# EAGLE design SCH1001-001-012-320 - Counter ALU (EAGLE 9.4.2)

## Sheet 1 of 2
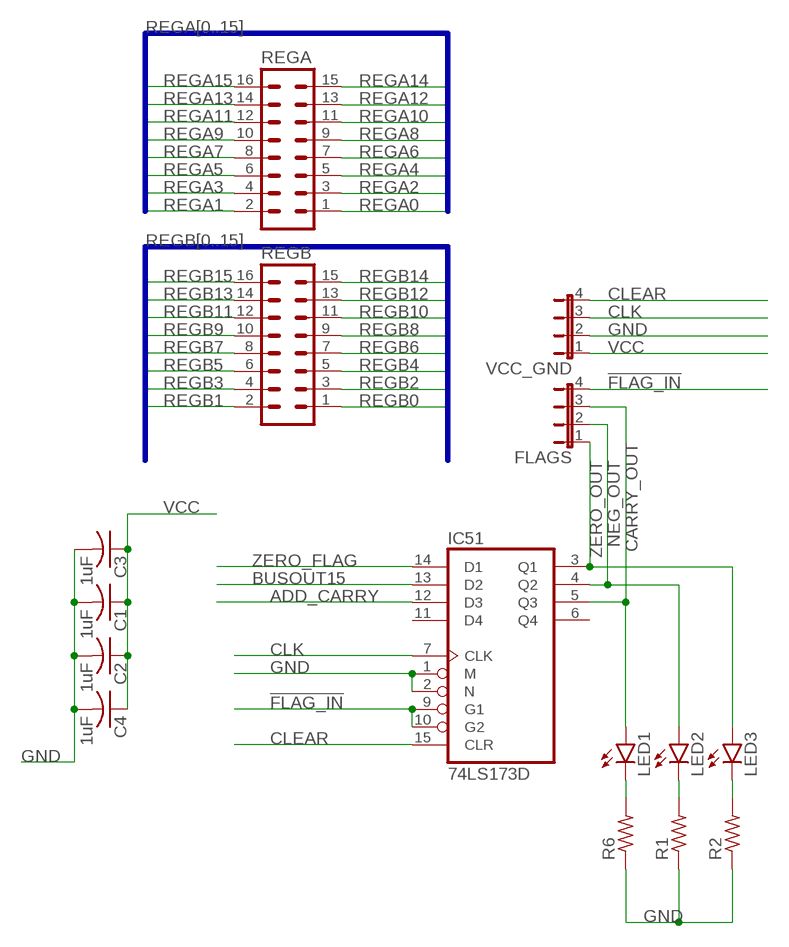
[diagram p0: schematic, sheet 1]

### Parts
C1  1uF  C-USC1206  [C1206]
C2  1uF  C-USC1206  [C1206]
C3  1uF  C-USC1206  [C1206]
C4  1uF  C-USC1206  [C1206]
FLAGS  JP4E  [JP4]
IC51  74LS173D  [SO16]
LED1  LED5MM  [LED5MM]
LED2  LED5MM  [LED5MM]
LED3  LED5MM  [LED5MM]
R1  R-US_M1206  [M1206]
R2  R-US_M1206  [M1206]
R6  R-US_M1206  [M1206]
REGA  ML16  [ML16]
REGB  ML16  [ML16]
VCC_GND  JP4E  [JP4]

### Nets
!FLAG_IN: FLAGS.4 IC51.9(G1) IC51.10(G2)
ADD_CARRY: IC51.12(D3) ; also sheet 2
BUSOUT15: IC51.13(D2) ; also sheet 2
CARRY_OUT: FLAGS.3 IC51.5(Q3) LED1.A
CLEAR: IC51.15(CLR) VCC_GND.4
CLK: IC51.7(CLK) VCC_GND.3
GND [power]: C1.2 C2.2 C3.2 C4.2 IC51.1(M) IC51.2(N) R1.1 R2.1 R6.1 VCC_GND.2
N$138: LED1.K(C) R6.2
N$139: LED2.K(C) R1.2
N$140: LED3.K(C) R2.2
NEG_OUT: FLAGS.2 IC51.4(Q2) LED2.A
REGA0: REGA.1 ; also sheet 2
REGA1: REGA.2 ; also sheet 2
REGA2: REGA.3 ; also sheet 2
REGA3: REGA.4 ; also sheet 2
REGA4: REGA.5 ; also sheet 2
REGA5: REGA.6 ; also sheet 2
REGA6: REGA.7 ; also sheet 2
REGA7: REGA.8 ; also sheet 2
REGA8: REGA.9 ; also sheet 2
REGA9: REGA.10 ; also sheet 2
REGA10: REGA.11 ; also sheet 2
REGA11: REGA.12 ; also sheet 2
REGA12: REGA.13 ; also sheet 2
REGA13: REGA.14 ; also sheet 2
REGA14: REGA.15 ; also sheet 2
REGA15: REGA.16 ; also sheet 2
REGB0: REGB.1 ; also sheet 2
REGB1: REGB.2 ; also sheet 2
REGB2: REGB.3 ; also sheet 2
REGB3: REGB.4 ; also sheet 2
REGB4: REGB.5 ; also sheet 2
REGB5: REGB.6 ; also sheet 2
REGB6: REGB.7 ; also sheet 2
REGB7: REGB.8 ; also sheet 2
REGB8: REGB.9 ; also sheet 2
REGB9: REGB.10 ; also sheet 2
REGB10: REGB.11 ; also sheet 2
REGB11: REGB.12 ; also sheet 2
REGB12: REGB.13 ; also sheet 2
REGB13: REGB.14 ; also sheet 2
REGB14: REGB.15 ; also sheet 2
REGB15: REGB.16 ; also sheet 2
VCC [power]: C1.1 C2.1 C3.1 C4.1 VCC_GND.1 ; also sheet 2
ZERO_FLAG: IC51.14(D1) ; also sheet 2
ZERO_OUT: FLAGS.1 IC51.3(Q1) LED3.A
Unconnected: IC51.6(Q4) IC51.11(D4)

### Buses
REGB[0..15]
REGA[0..15]

## Sheet 2 of 2
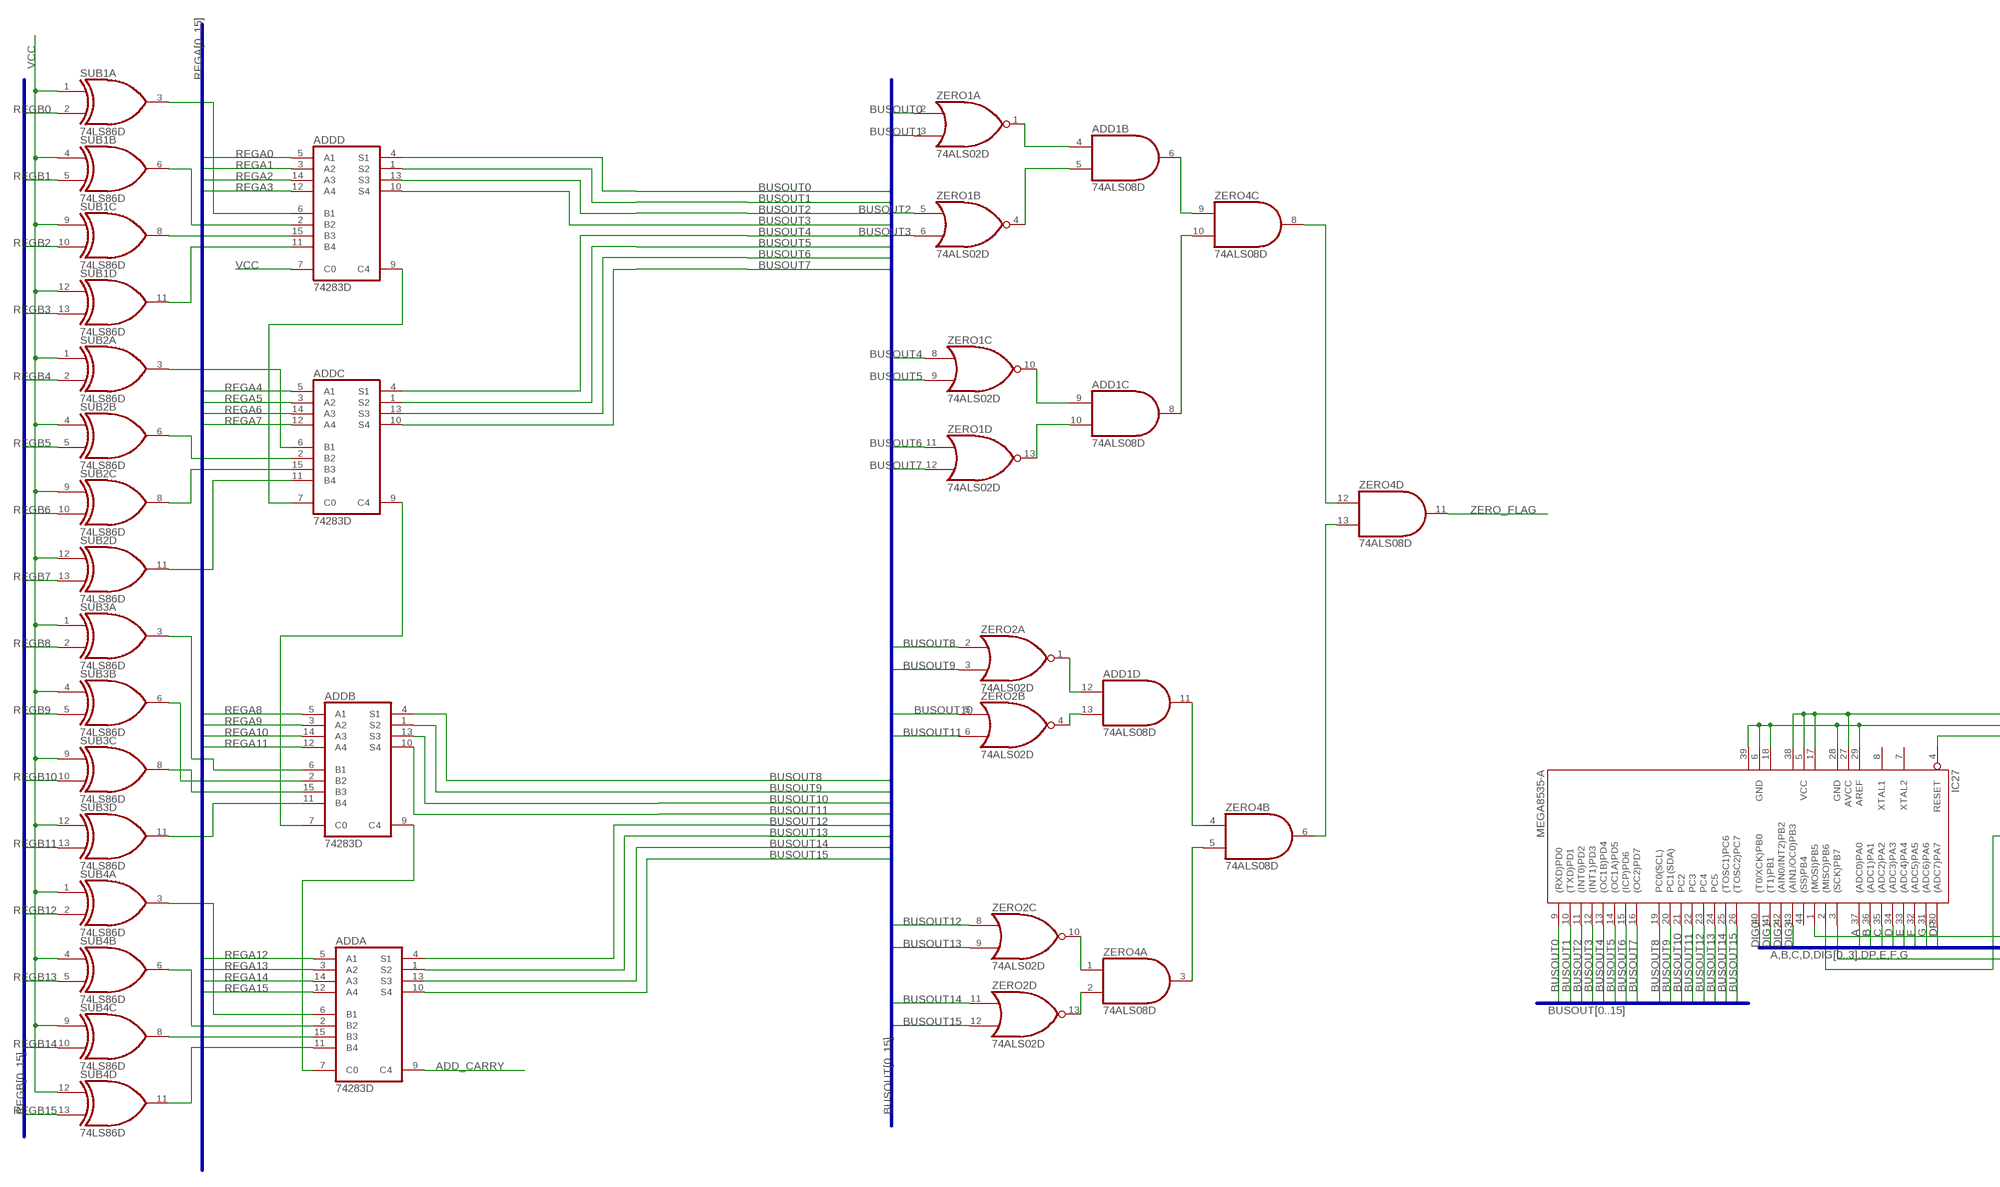
[diagram p1: schematic, sheet 2, part 1 of 2]
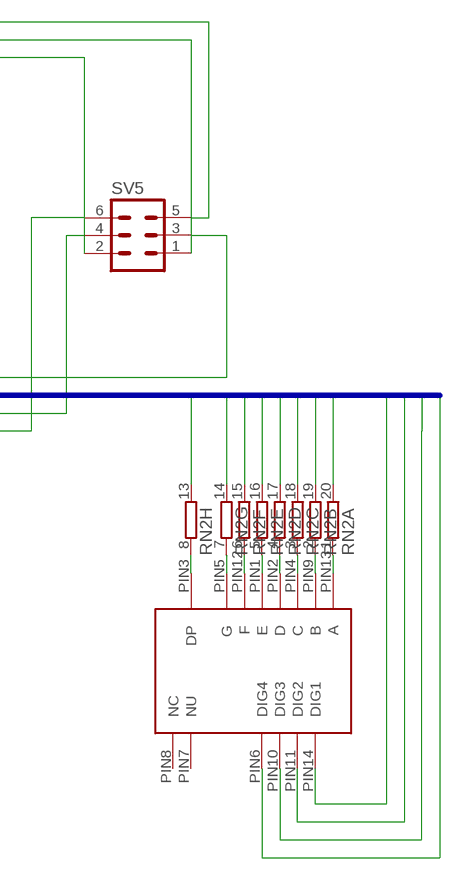
[diagram p2: schematic, sheet 2, part 2 of 2]

### Parts
ADD1  74ALS08D  [SO14]
ADDA  74283D  [SO16]
ADDB  74283D  [SO16]
ADDC  74283D  [SO16]
ADDD  74283D  [SO16]
IC27  MEGA8535-A  [TQFP44]
RN2  10R-NSOMC  [SOMC20]
SUB1  74LS86D  [SO14]
SUB2  74LS86D  [SO14]
SUB3  74LS86D  [SO14]
SUB4  74LS86D  [SO14]
SV5  ML6  [ML6]
U$1  4-DIGIT-7-SEGMENT  [4-DIGIT-7-SEGMENT]
ZERO1  74ALS02D  [SO14]
ZERO2  74ALS02D  [SO14]
ZERO4  74ALS08D  [SO14]

### Nets
A: IC27.37((ADC0)PA0) RN2.20
ADD_CARRY: ADDA.9(C4) ; also sheet 1
B: IC27.36((ADC1)PA1) RN2.19
BUSOUT0: ADDD.4(S1) IC27.9((RXD)PD0) ZERO1.2(A:I0)
BUSOUT1: ADDD.1(S2) IC27.10((TXD)PD1) ZERO1.3(A:I1)
BUSOUT2: ADDD.13(S3) IC27.11((INT0)PD2) ZERO1.5(B:I0)
BUSOUT3: ADDD.10(S4) IC27.12((INT1)PD3) ZERO1.6(B:I1)
BUSOUT4: ADDC.4(S1) IC27.13((OC1B)PD4) ZERO1.8(C:I0)
BUSOUT5: ADDC.1(S2) IC27.14((OC1A)PD5) ZERO1.9(C:I1)
BUSOUT6: ADDC.13(S3) IC27.15((ICP)PD6) ZERO1.11(D:I0)
BUSOUT7: ADDC.10(S4) IC27.16((OC2)PD7) ZERO1.12(D:I1)
BUSOUT8: ADDB.4(S1) IC27.19(PC0(SCL)) ZERO2.2(A:I0)
BUSOUT9: ADDB.1(S2) IC27.20(PC1(SDA)) ZERO2.3(A:I1)
BUSOUT10: ADDB.13(S3) IC27.21(PC2) ZERO2.5(B:I0)
BUSOUT11: ADDB.10(S4) IC27.22(PC3) ZERO2.6(B:I1)
BUSOUT12: ADDA.4(S1) IC27.23(PC4) ZERO2.8(C:I0)
BUSOUT13: ADDA.1(S2) IC27.24(PC5) ZERO2.9(C:I1)
BUSOUT14: ADDA.13(S3) IC27.25((TOSC1)PC6) ZERO2.11(D:I0)
BUSOUT15: ADDA.10(S4) IC27.26((TOSC2)PC7) ZERO2.12(D:I1) ; also sheet 1
C: IC27.35((ADC2)PA2) RN2.18
D: IC27.34((ADC3)PA3) RN2.17
DIG0: IC27.40((T0/XCK)PB0) U$1.PIN14(DIG1)
DIG1: IC27.41((T1)PB1) U$1.PIN11(DIG2)
DIG2: IC27.42((AIN0/INT2)PB2) U$1.PIN10(DIG3)
DIG3: IC27.43((AIN1/OC0)PB3) U$1.PIN6(DIG4)
DP: IC27.30((ADC7)PA7) RN2.13
E: IC27.33((ADC4)PA4) RN2.16
F: IC27.32((ADC5)PA5) RN2.15
G: IC27.31((ADC6)PA6) RN2.14
N$65: ADDD.6(B1) SUB1.3(A:O)
N$66: ADDD.2(B2) SUB1.6(B:O)
N$67: ADDD.15(B3) SUB1.8(C:O)
N$68: ADDD.11(B4) SUB1.11(D:O)
N$77: ADDC.6(B1) SUB2.3(A:O)
N$78: ADDC.2(B2) SUB2.6(B:O)
N$79: ADDC.15(B3) SUB2.8(C:O)
N$80: ADDC.11(B4) SUB2.11(D:O)
N$81: ADDC.7(C0) ADDD.9(C4)
N$82: ADDA.2(B2) SUB4.6(B:O)
N$83: ADDA.15(B3) SUB4.8(C:O)
N$84: ADDA.11(B4) SUB4.11(D:O)
N$85: ADDA.6(B1) SUB4.3(A:O)
N$86: ADDA.7(C0) ADDB.9(C4)
N$91: ADDB.11(B4) SUB3.11(D:O)
N$92: ADDB.15(B3) SUB3.8(C:O)
N$93: ADDB.2(B2) SUB3.6(B:O)
N$94: ADDB.6(B1) SUB3.3(A:O)
N$95: ADDB.7(C0) ADDC.9(C4)
N$101: ADD1.4(B:I0) ZERO1.1(A:O)
N$102: ADD1.5(B:I1) ZERO1.4(B:O)
N$103: ADD1.9(C:I0) ZERO1.10(C:O)
N$104: ADD1.10(C:I1) ZERO1.13(D:O)
N$105: ADD1.8(C:O) ZERO4.10(C:I1)
N$106: ADD1.6(B:O) ZERO4.9(C:I0)
N$107: ZERO4.8(C:O) ZERO4.12(D:I0)
N$108: ZERO4.6(B:O) ZERO4.13(D:I1)
N$109: ADD1.11(D:O) ZERO4.4(B:I0)
N$110: ZERO4.3(A:O) ZERO4.5(B:I1)
N$111: ZERO2.10(C:O) ZERO4.1(A:I0)
N$112: ZERO2.13(D:O) ZERO4.2(A:I1)
N$113: ADD1.12(D:I0) ZERO2.1(A:O)
N$114: ADD1.13(D:I1) ZERO2.4(B:O)
N$120: IC27.1((MOSI)PB5) SV5.3
N$121: IC27.3((SCK)PB7) SV5.4
N$122: IC27.2((MISO)PB6) SV5.6
N$123: IC27.4(RESET) SV5.2
N$124: RN2.1 U$1.PIN13(A)
N$125: RN2.2 U$1.PIN9(B)
N$126: RN2.3 U$1.PIN4(C)
N$127: RN2.4 U$1.PIN2(D)
N$128: RN2.5 U$1.PIN1(E)
N$129: RN2.6 U$1.PIN12(F)
N$130: RN2.7 U$1.PIN5(G)
N$141: RN2.8 U$1.PIN3(DP)
N$142: IC27.5(VCC) IC27.17(VCC1) IC27.27(AVCC) IC27.38(VCC2) SV5.5
N$143: IC27.6(GND) IC27.18(GND1) IC27.28(GND) IC27.29(AREF) IC27.39(GND2) SV5.1
REGA0: ADDD.5(A1) ; also sheet 1
REGA1: ADDD.3(A2) ; also sheet 1
REGA2: ADDD.14(A3) ; also sheet 1
REGA3: ADDD.12(A4) ; also sheet 1
REGA4: ADDC.5(A1) ; also sheet 1
REGA5: ADDC.3(A2) ; also sheet 1
REGA6: ADDC.14(A3) ; also sheet 1
REGA7: ADDC.12(A4) ; also sheet 1
REGA8: ADDB.5(A1) ; also sheet 1
REGA9: ADDB.3(A2) ; also sheet 1
REGA10: ADDB.14(A3) ; also sheet 1
REGA11: ADDB.12(A4) ; also sheet 1
REGA12: ADDA.5(A1) ; also sheet 1
REGA13: ADDA.3(A2) ; also sheet 1
REGA14: ADDA.14(A3) ; also sheet 1
REGA15: ADDA.12(A4) ; also sheet 1
REGB0: SUB1.2(A:I1) ; also sheet 1
REGB1: SUB1.5(B:I1) ; also sheet 1
REGB2: SUB1.10(C:I1) ; also sheet 1
REGB3: SUB1.13(D:I1) ; also sheet 1
REGB4: SUB2.2(A:I1) ; also sheet 1
REGB5: SUB2.5(B:I1) ; also sheet 1
REGB6: SUB2.10(C:I1) ; also sheet 1
REGB7: SUB2.13(D:I1) ; also sheet 1
REGB8: SUB3.2(A:I1) ; also sheet 1
REGB9: SUB3.5(B:I1) ; also sheet 1
REGB10: SUB3.10(C:I1) ; also sheet 1
REGB11: SUB3.13(D:I1) ; also sheet 1
REGB12: SUB4.2(A:I1) ; also sheet 1
REGB13: SUB4.5(B:I1) ; also sheet 1
REGB14: SUB4.10(C:I1) ; also sheet 1
REGB15: SUB4.13(D:I1) ; also sheet 1
VCC [power]: ADDD.7(C0) SUB1.1(A:I0) SUB1.4(B:I0) SUB1.9(C:I0) SUB1.12(D:I0) SUB2.1(A:I0) SUB2.4(B:I0) SUB2.9(C:I0) SUB2.12(D:I0) SUB3.1(A:I0) SUB3.4(B:I0) SUB3.9(C:I0) SUB3.12(D:I0) SUB4.1(A:I0) SUB4.4(B:I0) SUB4.9(C:I0) SUB4.12(D:I0) ; also sheet 1
ZERO_FLAG: ZERO4.11(D:O) ; also sheet 1
Unconnected: ADD1.1(A:I0) ADD1.2(A:I1) ADD1.3(A:O) IC27.7(XTAL2) IC27.8(XTAL1) IC27.44((SS)PB4) RN2.9 RN2.10 RN2.11 RN2.12 U$1.PIN7(NU) U$1.PIN8(NC)

### Buses
REGB[0..15]
BUSOUT[0..15]
REGA[0..15]
A,B,C,D,DIG[0..3],DP,E,F,G

## Power pins joined to a net without a drawn wire
GND: ADD1.7(P:GND) ADDA.8(GND) ADDB.8(GND) ADDC.8(GND) ADDD.8(GND) IC51.8(GND) SUB1.7(P:GND) SUB2.7(P:GND) SUB3.7(P:GND) SUB4.7(P:GND) ZERO1.7(P:GND) ZERO2.7(P:GND) ZERO4.7(P:GND)
VCC: ADD1.14(P:VCC) ADDA.16(VCC) ADDB.16(VCC) ADDC.16(VCC) ADDD.16(VCC) IC51.16(VCC) SUB1.14(P:VCC) SUB2.14(P:VCC) SUB3.14(P:VCC) SUB4.14(P:VCC) ZERO1.14(P:VCC) ZERO2.14(P:VCC) ZERO4.14(P:VCC)

## Library data of the parts
ADD1 ZERO4 = 74xx-us:74*08: Quad 2-input AND gate
ADDA ADDB ADDC ADDD = 74xx-us:74*283: 4-bit binary FULL ADDER, fast carry
C1-C4 = rcl:C-US: CAPACITOR, American symbol; SPICEPREFIX: C
FLAGS VCC_GND = jumper:JP4E: JUMPER
IC27 = atmel:MEGA8535: MICROCONTROLLER 8 Kbytes FLASH 512 bytes SRAM 512 bytes EEPROM USART 8-channel 10 bit ADC Source: avr.lbr; MPN: ATMEGA8535-16AU; OC_FARNELL: 1528437; OC_NEWARK: 01M6908
IC51 = 74xx-us:74*173: 4-bit D type REGISTER, 3-state
LED1-LED3 = led:LED: LED OSRAM: - CHIPLED LG R971, LG N971, LY N971, LG Q971, LY Q971, LO R971, LY R971 LH N974, LH R974 LS Q976, LO Q976, LY Q976 LO Q996 - Hyper CHIPLED LW Q18S LB Q993, LB Q99A, LB R99A - SideLED LS A670, LO A670, LY A670, LG A670, LP A670 LB A673, LV A673, LT A673, LW A673 LH A674 LY A675 LS A676, LA A676, LO A676, LY A676, LW A676 LS A679, LY A679, LG A679 - Hyper Micro SIDELED® LS Y876, LA Y876, LO Y876, LY Y876 LT Y87S - SmartLED LW L88C, LW L88S LB L89C, LB L89S, LG L890 LS L89K, LO L89K, LY L89K LS L896, LA L896, LO L896, LY L896 - TOPLED LS T670, LO T670, LY T670, LG T670, LP T670 LSG T670, LSP T670, LSY T670, LOP T670, LYG T670 LG T671, LOG T671, LSG T671 LB T673, LV T673, LT T673, LW T673 LH T674 LS T676, LA T676, LO T676, LY T676, LB T676, LH T676, LSB T676, LW T676 LB T67C, LV T67C, LT T67C, LS T67K, LO T67K, LY T67K, LW E67C LS E67B, LA E67B, LO E67B, LY E67B, LB E67C, LV E67C, LT E67C LW T67C LS T679, LY T679, LG T679 LS T770, LO T770, LY T770, LG T770, LP T770 LB T773, LV T773, LT T773, LW T773 LH T774 LS E675, LA E675, LY E675, LS T675 LS T776, LA T776, LO T776, LY T776, LB T776 LHGB T686 LT T68C, LB T68C - Hyper Mini TOPLED® LB M676 - Mini TOPLED Santana® LG M470 LS M47K, LO M47K, LY M47K Source: http://www.osram.convergy.de LUXEON: - LUMILED® LXK2-PW12-R00, LXK2-PW12-S00, LXK2-PW14-U00, LXK2-PW14-V00 LXK2-PM12-R00, LXK2-PM12-S00, LXK2-PM14-U00 LXK2-PE12-Q00, LXK2-PE12-R00, LXK2-PE12-S00, LXK2-PE14-T00, LXK2-PE14-U00 LXK2-PB12-K00, LXK2-PB12-L00, LXK2-PB12-M00, LXK2-PB14-N00, LXK2-PB14-P00, LXK2-PB14-Q00 LXK2-PR12-L00, LXK2-PR12-M00, LXK2-PR14-Q00, LXK2-PR14-R00 LXK2-PD12-Q00, LXK2-PD12-R00, LXK2-PD12-S00 LXK2-PH12-R00, LXK2-PH12-S00 LXK2-PL12-P00, LXK2-PL12-Q00, LXK2-PL12-R00 Source: www.luxeon.com KINGBRIGHT: KA-3528ASYC Source: www.kingbright.com
R1 R2 R6 = rcl:R-US_: RESISTOR, American symbol; SPICEPREFIX: R
REGA REGB = con-harting-ml:ML16: HARTING; OC_FARNELL: unknown; OC_NEWARK: unknown
RN2 = resistor-dil:10R-N: DIL RESISTOR; OC_FARNELL: unknown; OC_NEWARK: unknown
SUB1-SUB4 = 74xx-us:74*86: Quad 2-input EXCLUSIV-OR (XOR) gate
SV5 = con-harting-ml:ML6: HARTING; OC_FARNELL: unknown; OC_NEWARK: unknown
U$1 = ADAFRUIT:4-DIGIT-7-SEGMENT
ZERO1 ZERO2 = 74xx-us:74*02: Quad 2-input NOR gate

## Net classes
1 power: width 0.457 mm

## Board
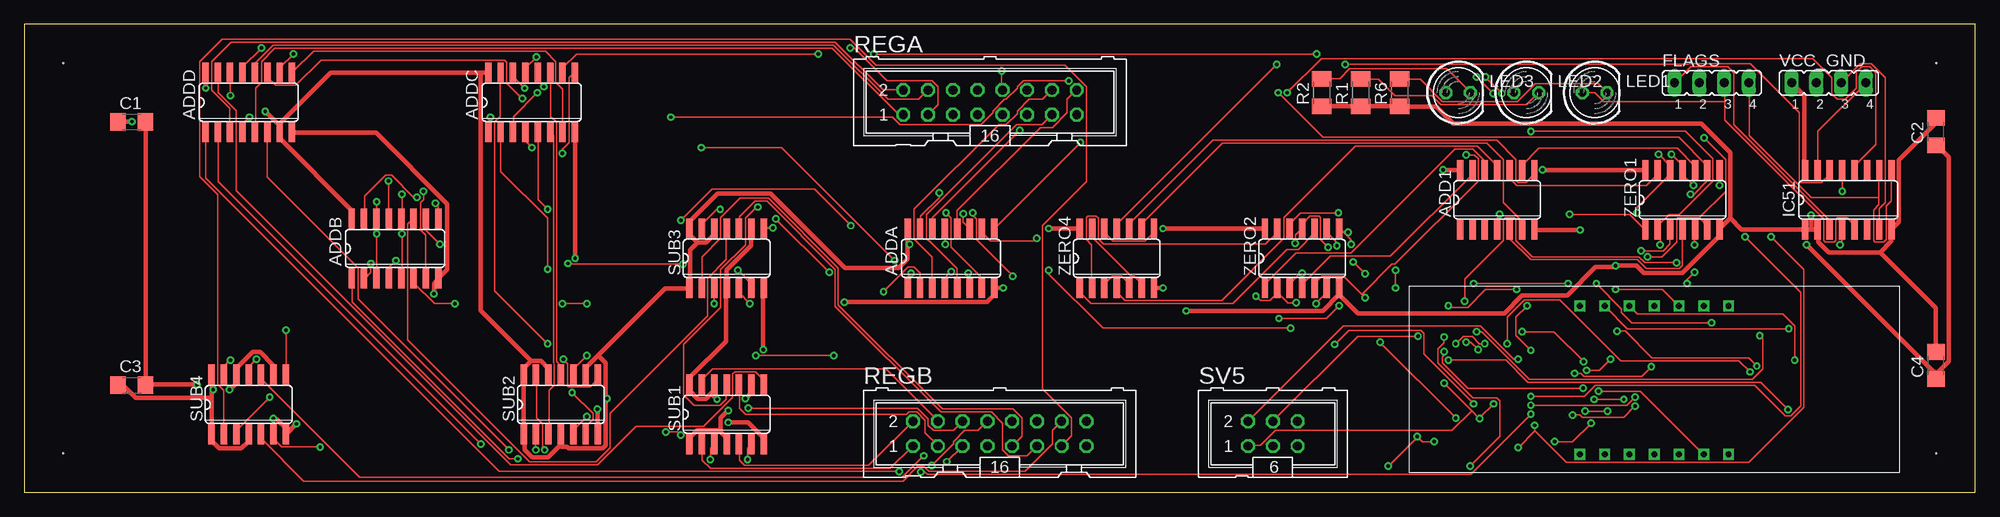
[diagram p3: board, top side]
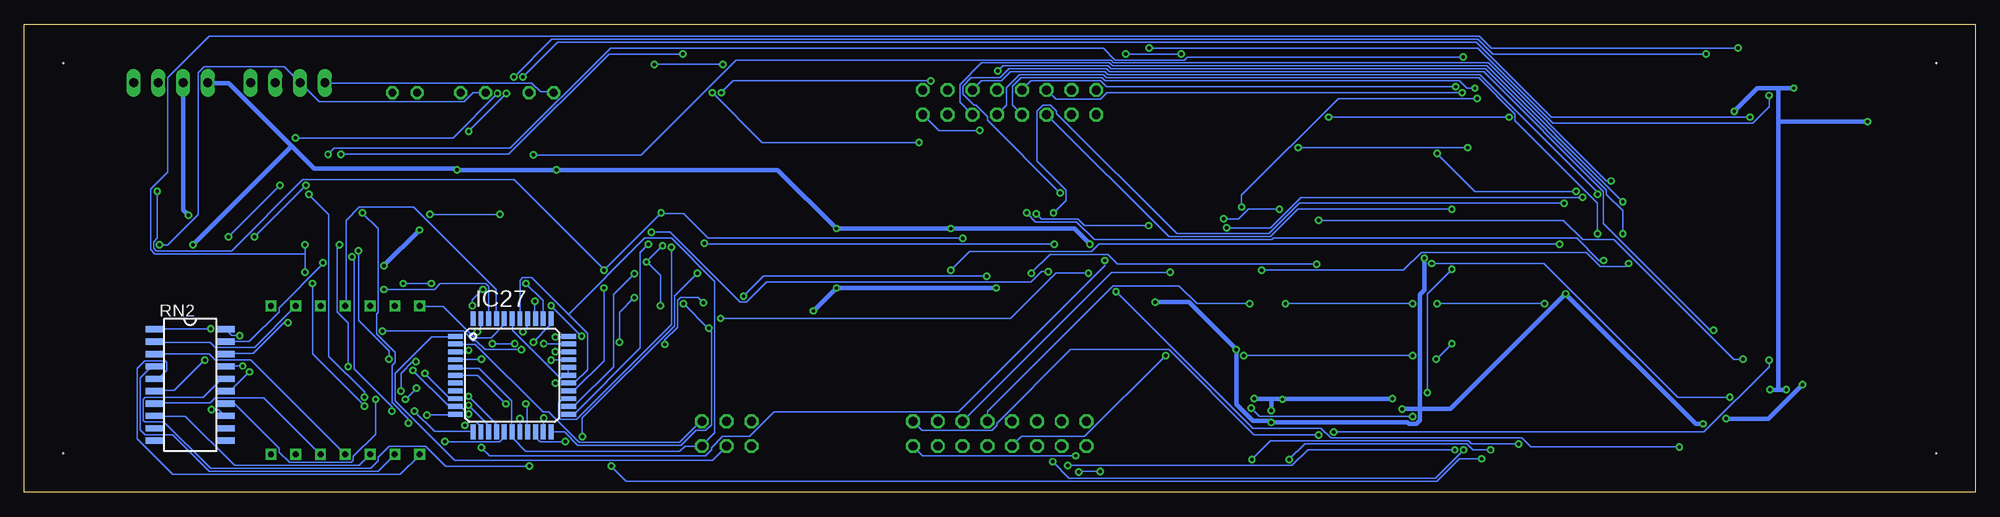
[diagram p4: board, bottom side, seen from below]

Size 200 x 48 mm. Coordinates in mm from the lower left corner, seen from the top.
Outline: 0,0 200,0 200,48 0,48 0,0
Copper layers (1*16): Top 0.035mm / dielectric 1.5mm / Bottom 0.035mm
Design rules "default *": minimum track width 6mil, minimum drill 0.35mm, track to track 6mil, track to pad 6mil, pad to pad 6mil, via to via 6mil, smd to smd 6mil, copper to edge 40mil, drill to drill 6mil, minimum pad ring 10mil, minimum via ring 8mil, stop-mask expansion 4mil, vias tented up to drill 0mil, thermal gap 10mil
Holes 0.12 mm at 4,4 196,44 4,44 196,4

### Footprints (pad centres in the part's own frame; a part is rotated, then mirrored left to right if it is on the bottom)
SO14 = smd 0.66 x 2.032: 1 -3.81,-3.073; 2 -2.54,-3.073; 3 -1.27,-3.073; 4 0,-3.073; 5 1.27,-3.073; 6 2.54,-3.073; 7 3.81,-3.073; 8 3.81,3.073; 9 2.54,3.073; 10 1.27,3.073; 11 0,3.073; 12 -1.27,3.073; 13 -2.54,3.073; 14 -3.81,3.073
SO16 = smd 0.66 x 2.032: 1 -4.445,-3.073; 2 -3.175,-3.073; 3 -1.905,-3.073; 4 -0.635,-3.073; 5 0.635,-3.073; 6 1.905,-3.073; 7 3.175,-3.073; 8 4.445,-3.073; 9 4.445,3.073; 10 3.175,3.073; 11 1.905,3.073; 12 0.635,3.073; 13 -0.635,3.073; 14 -1.905,3.073; 15 -3.175,3.073; 16 -4.445,3.073
C1206 = smd 1.6 x 1.8: 1 -1.4,0; 2 1.4,0
JP4 = drill 0.914 long: 1 -3.81,0; 2 -1.27,0; 3 1.27,0; 4 3.81,0
TQFP44 = smd 1.5 x 0.5: 1 -5.8,4; 2 -5.8,3.2; 3 -5.8,2.4; 4 -5.8,1.6; 5 -5.8,0.8; 6 -5.8,0; 7 -5.8,-0.8; 8 -5.8,-1.6; 9 -5.8,-2.4; 10 -5.8,-3.2; 11 -5.8,-4; 23 5.8,-4; 24 5.8,-3.2; 25 5.8,-2.4; 26 5.8,-1.6; 27 5.8,-0.8; 28 5.8,0; 29 5.8,0.8; 30 5.8,1.6; 31 5.8,2.4; 32 5.8,3.2; 33 5.8,4 | smd 0.5 x 1.5: 12 -4,-5.8; 13 -3.2,-5.8; 14 -2.4,-5.8; 15 -1.6,-5.8; 16 -0.8,-5.8; 17 0,-5.8; 18 0.8,-5.8; 19 1.6,-5.8; 20 2.4,-5.8; 21 3.2,-5.8; 22 4,-5.8; 34 4,5.8; 35 3.2,5.8; 36 2.4,5.8; 37 1.6,5.8; 38 0.8,5.8; 39 0,5.8; 40 -0.8,5.8; 41 -1.6,5.8; 42 -2.4,5.8; 43 -3.2,5.8; 44 -4,5.8
LED5MM = drill 0.813 octagon: A -1.27,0; K 1.27,0
M1206 = smd 1.6 x 2: 1 -1.4,0; 2 1.4,0
ML16 = drill 0.914 octagon: 1 -8.89,-1.27; 2 -8.89,1.27; 3 -6.35,-1.27; 4 -6.35,1.27; 5 -3.81,-1.27; 6 -3.81,1.27; 7 -1.27,-1.27; 8 -1.27,1.27; 9 1.27,-1.27; 10 1.27,1.27; 11 3.81,-1.27; 12 3.81,1.27; 13 6.35,-1.27; 14 6.35,1.27; 15 8.89,-1.27; 16 8.89,1.27
SOMC20 = smd 1.91 x 0.64: 1 -3.62,5.715; 2 -3.62,4.445; 3 -3.62,3.175; 4 -3.62,1.905; 5 -3.62,0.635; 6 -3.62,-0.635; 7 -3.62,-1.905; 8 -3.62,-3.175; 9 -3.62,-4.445; 10 -3.62,-5.715; 11 3.62,-5.715; 12 3.62,-4.445; 13 3.62,-3.175; 14 3.62,-1.905; 15 3.62,-0.635; 16 3.62,0.635; 17 3.62,1.905; 18 3.62,3.175; 19 3.62,4.445; 20 3.62,5.715
ML6 = drill 0.914 octagon: 1 -2.54,-1.27; 2 -2.54,1.27; 3 0,-1.27; 4 0,1.27; 5 2.54,-1.27; 6 2.54,1.27
4-DIGIT-7-SEGMENT = drill 0.6 square: PIN1 17.48,1.88; PIN2 20.02,1.88; PIN3 22.56,1.88; PIN4 25.1,1.88; PIN5 27.64,1.88; PIN6 30.18,1.88; PIN7 32.72,1.88; PIN8 32.72,17.12; PIN9 30.18,17.12; PIN10 27.64,17.12; PIN11 25.1,17.12; PIN12 22.56,17.12; PIN13 20.02,17.12; PIN14 17.48,17.12

### Placement (x,y rotation side)
ADD1  151,30 0 top
ADDA  95,24 0 top
ADDB  38,25 0 top
ADDC  52,40 0 top
ADDD  23,40 0 top
C1  11,38 0 top
C2  196,37 90 top
C3  11,11 0 top
C4  196,13 90 top
FLAGS  173,42 0 top
IC27  150,12 0 bottom
IC51  187,30 0 top
LED1  161,41 0 top
LED2  154,41 0 top
LED3  147,41 0 top
R1  137,41 90 top
R2  133,41 90 top
R6  141,41 90 top
REGA  99,40 0 top
REGB  100,6 0 top
RN2  183,11 0 bottom
SUB1  72,8 0 top
SUB2  55,9 0 top
SUB3  72,24 0 top
SUB4  23,9 0 top
SV5  128,6 0 top
U$1  142,2 0 top
VCC_GND  185,42 0 top
ZERO1  170,30 0 top
ZERO2  131,24 0 top
ZERO4  112,24 0 top

### Tracks (layer width: path | path; a pad name or v marks a point on that pad's centre or on a via)
!FLAG_IN
  Top 0.152: 190.12,30.25 190.12,29.49 189.59,28.96 189.59,25.83 189.74,25.68 190.65,25.68 190.88,25.91 190.88,29.34 191.41,29.87 191.41,33.07 IC51.9 | 190.12,30.25 190.12,33.07 IC51.10 | 190.12,30.25 183.19,30.25 176.86,36.58 176.86,41.99 FLAGS.4
A  (via drill 0.35)
  Top 0.152: v148.9,16.46 149.43,16.46 154.31,11.58 177.16,11.58 178.23,12.65 178.23,15.77 v177.93,16.08
  Bottom 0.152: v148.9,16.46 148.44,16.92 148.44,17.75 IC27.37 | v177.93,16.08 178.76,16.08 179.38,16.69 RN2.20
ADD_CARRY  (via drill 0.35)
  Top 0.152: v108.28,35.89 99.52,27.13 ADDA.9 | v129.46,41 132.97,44.5 183.34,44.5 185.32,42.52 185.32,40.84 185.85,40.31 186.69,40.31 187.83,41.45 187.83,43.13 188.37,43.66 189.21,43.66 189.81,43.05 189.81,35.66 187.68,33.53 187.68,33.15 IC51.12
  Bottom 0.152: v108.28,35.89 124.36,35.89 v129.46,41
B  (via drill 0.35)
  Top 0.152: v147.68,19.58 147.68,21.87 151.64,25.83 151.64,27.96 151.87,28.19 152.71,28.19 152.93,27.96 152.93,25.83 154.61,24.16 165.51,24.16 166.12,23.55 v169.39,23.55
  Bottom 0.152: v147.68,19.58 147.68,17.83 IC27.36 | v169.39,23.55 169.39,23.39 173.89,18.9 173.89,18.52 176.94,15.47 179.38,15.47 RN2.19
BUSOUT0  (via drill 0.35)
  Top 0.152: v158.95,12.19 159.56,12.19 159.87,11.89 165.81,11.89 v166.8,12.88 | v167.72,25.38 167.72,26.67 167.49,26.9 ZERO1.2 167.49,26.98 167.49,27.36 168.63,28.5 169.7,28.5 173.13,31.93 173.13,34.21 170.31,37.03 v154.46,37.03 | v23.09,38.48 22.4,37.8 22.4,36.96 ADDD.4 | v150.57,40.92 v148.9,42.6
  Bottom 0.152: v158.95,12.19 156.36,9.6 155.83,9.6 IC27.9 | v166.8,12.88 166.8,17.37 167.94,18.52 167.94,25.15 v167.72,25.38 | v23.09,38.48 43.43,38.48 51.13,46.18 145.31,46.18 v148.9,42.6 | v154.46,37.03 v150.57,40.92
BUSOUT1  (via drill 0.35)
  Top 0.152: v160.17,12.5 161.47,12.5 v162.61,13.64 | v165.74,24.77 168.02,24.77 168.71,25.45 168.71,26.9 ZERO1.3 | v89.69,2.13 48.69,2.13 18.59,32.23 18.59,36.88 ADDD.1 | v91.9,2.06 92.35,2.06 92.58,1.83 148.28,1.83 v154.46,8
  Bottom 0.152: v160.17,12.5 156.51,8.84 155.83,8.84 IC27.10 155.75,8.76 155.22,8.76 v154.46,8 | v162.61,13.64 162.61,14.48 165.74,17.6 v165.74,24.77 | v89.69,2.13 91.82,2.13 v91.9,2.06
BUSOUT2  (via drill 0.35)
  Top 0.152: v158.72,7.92 159.49,7.92 159.72,7.7 163.98,7.7 v165.12,8.84 | v170.46,21.41 170.46,21.79 v171.22,22.55 | v171.22,25.38 171.22,26.9 ZERO1.5 | v24.31,45.57 22.4,43.66 22.4,43.13 ADDD.13
  Bottom 0.152: v158.72,7.92 155.83,7.92 IC27.11 | v165.12,8.84 170.46,14.17 v170.46,21.41 | v171.22,25.38 171.22,24.46 | 171.22,24.46 v171.22,22.55 | v24.31,45.57 49.61,45.57 50.83,46.79 181.05,46.79 185.32,42.52 185.32,32.84 187.07,31.09 187.07,24.92 186.61,24.46 171.22,24.46
BUSOUT3  (via drill 0.35)
  Top 0.152: v162.31,8.31 v160.02,8.31 | v166.42,24.16 167.87,24.16 169.39,25.68 169.39,28.04 169.54,28.19 171.68,28.19 171.72,28.16 | 171.72,28.16 172.52,27.36 172.52,26.98 ZERO1.6 | v27.58,44.96 26.21,43.59 26.21,43.13 ADDD.10 | v151.49,40.92 v149.81,42.6 | v172.21,36.35 174.42,34.14 174.42,30.86 171.72,28.16
  Bottom 0.152: v160.02,8.31 157.96,6.25 154,6.25 IC27.12 | v162.31,8.31 162.31,8.76 166.19,12.65 166.19,23.93 v166.42,24.16 | v27.58,44.96 49.45,44.96 50.98,46.48 145.92,46.48 v149.81,42.6 | v151.49,40.92 156.06,36.35 v172.21,36.35
BUSOUT4  (via drill 0.35)
  Top 0.152: v154.84,6.86 154.84,6.33 154.88,6.29 | 154.88,6.29 158.12,3.05 176.78,3.05 182.42,8.69 182.42,22.86 v179.07,26.21 | v173.81,31.47 ZERO1.8 | v52.05,35.36 51.44,35.97 51.44,36.88 ADDC.4 | v69.42,35.36 77.65,35.36 v89.23,23.77 | 154.88,6.29 v153.16,4.57
  Bottom 0.152: v154.84,6.86 154.46,7.24 153.69,7.24 153.24,6.78 153.24,6.25 IC27.13 | v173.81,31.47 v179.07,26.21 | v69.42,35.36 v52.05,35.36 | v89.23,23.77 89.23,23.24 104.24,8.23 123.14,8.23 125.65,5.71 128.4,5.71 129.54,4.57 129.54,4.34 130.15,3.73 152.32,3.73 v153.16,4.57
BUSOUT5  (via drill 0.35)
  Top 0.152: v154.46,8.91 164.29,8.91 v165.12,9.75 | v170.84,30.56 171.15,30.56 172.52,31.93 172.52,33.07 ZERO1.9 172.52,33.15 172.52,33.53 169.62,36.42 133.12,36.42 v128.55,41 | v47.78,38.48 47.62,38.33 47.62,36.96 ADDC.1 | v66.29,38.48 89,38.48 89.76,37.72 98.07,37.72 99.29,38.94 99.29,39.09 100.51,40.31 100.66,40.31 101.8,41.45 101.8,41.6 102.41,42.22 v107.06,42.22
  Bottom 0.152: IC27.14 152.4,6.86 v154.46,8.91 | v165.12,9.75 165.12,10.29 168.78,13.95 168.78,28.5 v170.84,30.56 | v66.29,38.48 v47.78,38.48 | v107.06,42.22 127.33,42.22 v128.55,41
BUSOUT6  (via drill 0.35)
  Top 0.152: v154.46,9.83 159.94,9.83 161.09,10.97 177.39,10.97 180.52,7.85 181.13,7.85 182.12,8.84 182.12,20.5 v176.4,26.21 | v171.15,31.47 170,32.61 ZERO1.11 169.93,33.15 169.93,33.6 v168.86,34.67 | v52.5,44.65 51.44,43.59 51.44,43.13 ADDC.13
  Bottom 0.152: v154.46,9.83 151.64,7.01 151.64,6.25 IC27.15 | v171.15,31.47 v176.4,26.21 | v52.5,44.65 80.77,44.65 81.08,44.35 88.16,44.35 89.38,45.57 139.9,45.57 150.19,35.28 168.25,35.28 v168.86,34.67
BUSOUT7  (via drill 0.35)
  Top 0.152: v156.9,5.18 158.72,5.18 v160.63,7.09 | v165.35,28.65 165.35,29.26 168.71,32.61 168.71,33.07 ZERO1.12 168.71,33.15 168.71,33.53 v167.56,34.67 | v81.38,44.96 56.62,44.96 55.24,43.59 55.24,43.13 ADDC.10 | v132.51,44.96 v87.1,44.96
  Bottom 0.152: v156.9,5.18 151.26,5.18 150.88,5.56 150.88,6.17 IC27.16 | v160.63,7.09 160.63,7.54 162.31,9.22 162.31,13.03 162,13.34 162,14.33 163.91,16.23 163.91,18.29 163.75,18.44 163.75,27.05 v165.35,28.65 | v87.1,44.96 v81.38,44.96 | v132.51,44.96 140.06,44.96 150.34,34.67 v167.56,34.67
BUSOUT8  (via drill 0.35)
  Top 0.152: v148.59,9.07 143.49,14.17 143.49,16.31 143.18,16.61 135.79,16.61 v134.34,15.16 | v130.38,19.43 129.54,19.43 128.47,20.5 128.47,20.88 ZERO2.2 128.47,20.42 127.71,19.66 126.72,19.66 v126.26,20.12 | v38.1,23.77 37.41,23.09 37.41,21.95 ADDB.4 | v97.23,28.65 97.23,28.42 97.61,28.04 97.61,25.91 v101.35,22.17
  Bottom 0.152: v148.59,9.07 148.44,8.91 148.44,6.25 IC27.19 | v134.34,15.16 134.34,15.62 133.04,16.92 133.04,19.66 132.74,19.96 130.91,19.96 v130.38,19.43 | v38.1,23.77 38.56,23.77 40.84,26.06 71.93,26.06 72.08,25.91 90.3,25.91 92.13,27.74 96.32,27.74 v97.23,28.65 | v101.35,22.17 124.21,22.17 v126.26,20.12
BUSOUT9  (via drill 0.35)
  Top 0.152: v144.55,5.18 143.33,5.18 v142.8,5.71 142.8,5.64 v139.83,2.67 | v130.99,22.48 130.84,22.48 129.77,21.41 129.77,20.95 ZERO2.3 | v50.6,3.43 49.68,3.43 33.6,19.51 33.6,21.87 ADDB.1
  Bottom 0.152: v144.55,5.18 147.14,5.18 147.6,5.64 147.6,6.17 IC27.20 | v142.8,5.71 142.8,7.62 133.35,17.07 133.35,20.12 v130.99,22.48 | v50.6,3.43 52.88,3.43 55.17,1.14 138.3,1.14 v139.83,2.67
BUSOUT10  (via drill 0.35)
  Top 0.152: v138.99,15.39 v146.76,7.62 | 137.12,20.31 135.25,22.17 133.04,22.17 132.28,21.41 132.28,20.95 ZERO2.5 | 137.12,20.31 v137.47,19.96 | v37.34,31.93 37.34,28.12 ADDB.13 | v147.83,34.59 148.67,34.59 149.05,34.21 149.05,31.93 140.51,23.39 140.21,23.39 137.12,20.31
  Bottom 0.152: v146.76,7.62 146.76,6.25 IC27.21 | v138.99,15.39 138.99,18.44 v137.47,19.96 | v37.34,31.93 37.8,31.93 49.91,44.04 88.32,44.04 88.62,44.35 127.03,44.35 136.78,34.59 v147.83,34.59
BUSOUT11  (via drill 0.35)
  Top 0.152: v132.44,19.36 133.5,20.42 133.5,20.88 ZERO2.6 | v42.6,25.45 41.22,26.82 41.22,28.04 ADDB.10 | v105,22.78 105,22.4 110.57,16.84 v129.84,16.84
  Bottom 0.152: v132.44,19.36 129.88,16.8 | 129.88,16.8 129.54,16.46 129.54,6.93 130.15,6.33 131.14,6.33 132.66,4.8 143.26,4.8 144.63,6.17 146,6.17 IC27.22 | v42.6,25.45 89.84,25.45 90.6,24.69 103.1,24.69 v105,22.78 | v129.84,16.84 129.88,16.8
BUSOUT12  (via drill 0.35)
  Top 0.152: v136.02,25.45 136.02,25.91 135.48,26.44 | 135.48,26.44 134.87,27.05 ZERO2.8 | v95.02,22.63 94.41,22.02 94.41,20.95 ADDA.4 | 135.48,26.44 v135.71,26.67
  Bottom 0.152: v136.02,25.45 136.85,24.61 136.85,14.78 143.64,8 144.17,8 IC27.23 | v95.02,22.63 95.71,22.63 96.77,21.57 123.9,21.57 125.96,19.51 126.64,19.51 133.81,26.67 v135.71,26.67
BUSOUT13  (via drill 0.35)
  Top 0.152: v136.25,23.62 v137.47,22.4 | v134.57,25.3 134.57,25.6 133.58,26.59 133.58,27.05 ZERO2.9 | v90.91,22.48 90.6,22.17 90.6,20.95 ADDA.1 | v128.63,17.83 133.5,17.83 v134.8,19.13
  Bottom 0.152: v137.47,22.4 139.6,20.27 139.6,12.88 143.64,8.84 144.17,8.84 IC27.24 | v134.57,25.3 v136.25,23.62 136.17,23.62 134.8,22.25 v134.8,19.13 | v90.91,22.48 94.26,22.48 98.91,17.83 v128.63,17.83
BUSOUT14  (via drill 0.35)
  Top 0.152: v133.66,25.15 132.89,25.91 132.89,28.19 132.74,28.35 131.83,28.35 131.06,27.58 131.06,27.13 ZERO2.11 130.99,27.05 130.3,26.36 v130.3,25.53 | v94.41,25.45 94.41,27.05 ADDA.13
  Bottom 0.152: v133.66,25.15 133.66,17.22 143.41,7.47 145.01,7.47 145.24,7.7 145.24,9.14 144.86,9.53 144.25,9.53 IC27.25 | v94.41,25.45 130.23,25.45 v130.3,25.53
BUSOUT15  (via drill 0.35)
  Top 0.152: v140.59,22.78 v140.59,20.95 | v134.72,28.65 130.84,28.65 129.77,27.58 129.77,27.13 ZERO2.12 | v103.78,26.06 103.48,25.76 99.06,25.76 98.22,26.59 98.22,27.05 ADDA.10 | v186.38,30.86 186.38,33.07 IC51.13
  Bottom 0.152: v140.59,20.95 140.59,13.49 143.64,10.44 144.17,10.44 IC27.26 | v103.78,26.06 129.92,26.06 132.44,28.57 134.72,28.57 v134.72,28.65 v140.59,22.78 140.59,22.86 149.81,32.08 171.45,32.08 178.76,24.77 186.46,24.77 186.77,25.07 186.77,25.68 186.38,26.06 v186.38,30.86
C  (via drill 0.35)
  Top 0.152: v158.27,21.41 v148.59,21.41 | v161.16,21.41 163.75,18.82 163.75,18.44 164.82,17.37 v172.97,17.37
  Bottom 0.152: v148.59,21.41 146.84,19.66 146.84,17.83 IC27.35 | v161.16,21.41 v158.27,21.41 | v172.97,17.37 173.43,17.37 176.56,14.25 179.38,14.25 RN2.18
CARRY_OUT
  Top 0.152: 174.35,40.08 174.35,41.99 FLAGS.3 | 174.35,40.08 174.35,38.18 184.48,28.04 184.48,25.83 184.63,25.68 185.55,25.68 185.7,25.83 185.7,27.96 185.93,28.19 186.84,28.19 187.6,27.43 187.6,26.98 IC51.5 | 174.35,40.08 161.93,40.08 161.01,41 159.79,41 LED1.A
CLEAR
  Top 0.152: IC51.15 183.87,33.15 183.87,37.03 188.82,41.99 VCC_GND.4
CLK
  Top 0.152: IC51.7 190.19,26.98 190.19,29.11 190.81,29.72 190.81,42.52 189.36,43.97 188.21,43.97 186.31,42.06 VCC_GND.3
D  (via drill 0.35)
  Top 0.152: v147.83,15.39 148.28,15.39 v149.05,14.63 | v163.3,16.54 164.13,16.54 166.88,13.79 176.78,13.79 v177.62,12.95
  Bottom 0.152: v147.83,15.39 146.07,17.14 146.07,17.75 IC27.34 | v149.05,14.63 152.78,14.63 153.69,15.54 154,15.54 154.99,16.54 v163.3,16.54 | v177.62,12.95 179.38,12.95 RN2.17
DIG0
  Bottom 0.152: IC27.40 150.88,17.75 150.88,17.14 152.17,15.85 153.85,15.85 157.05,19.05 159.41,19.05 U$1.PIN14
DIG1
  Bottom 0.152: IC27.41 151.64,17.83 151.64,20.8 160.1,29.26 165.66,29.26 167.03,27.89 167.03,19.13 U$1.PIN11
DIG2  (via drill 0.35)
  Top 0.152: v163.14,20.8 167.94,20.8 169.62,19.13 U$1.PIN10
  Bottom 0.152: IC27.42 152.4,21.11 152.71,21.41 157.35,21.41 157.96,20.8 v163.14,20.8
DIG3  (via drill 0.35)
  Top 0.152: v153.54,16.46 156.82,16.46 v159.87,13.41 | v161.39,10.36 165.66,10.36 172.14,3.89 U$1.PIN6
  Bottom 0.152: v153.54,16.46 153.24,16.76 153.24,17.75 IC27.43 | v159.87,13.41 160.17,13.41 161.39,12.19 v161.39,10.36
DP  (via drill 0.35)
  Top 0.152: v146,13.56 151.87,13.56 154.15,11.28 178,11.28 v180.82,8.46
  Bottom 0.152: v146,13.56 144.25,13.56 IC27.30 | v180.82,8.46 180.06,8.46 179.45,7.85 RN2.13
E  (via drill 0.35)
  Top 0.152: v145.54,15.93 145.54,15.32 144.93,14.71 144.93,13.26 148.51,9.68 150.95,9.68 151.26,9.37 151.26,5.71 v148.21,2.67
  Bottom 0.152: v145.54,15.93 144.25,15.93 IC27.33 | v148.21,2.67 156.82,2.67 158.88,4.72 162.61,4.72 163.75,3.58 163.75,3.2 164.52,2.44 180.9,2.44 185.7,7.24 187.68,7.24 187.83,7.39 187.83,9.53 187.6,9.75 181.66,9.75 179.83,11.58 179.45,11.58 RN2.16
F  (via drill 0.35)
  Top 0.152: v146.76,15.24 147.52,16 148.44,16 149.2,15.24 v149.73,15.24 | v152.02,15.24 152.02,17.98 153.77,19.74 157.43,19.74 163.68,13.49 175.79,13.49 v176.94,12.34
  Bottom 0.152: v146.76,15.24 144.25,15.24 IC27.32 | v152.02,15.24 v149.73,15.24 | v176.94,12.34 178.84,10.44 179.38,10.44 RN2.15
G  (via drill 0.35)
  Top 0.152: v145.54,14.4 145.54,14.02 145.39,13.87 145.39,13.26 147.98,10.67 v159.79,10.67 | v163.98,9.53 v160.93,9.53
  Bottom 0.152: v145.54,14.4 144.25,14.4 IC27.31 | v160.93,9.53 v159.79,10.67 | v163.98,9.53 163.98,5.94 166.27,3.66 166.27,3.28 166.5,3.05 172.82,3.05 173.89,4.12 173.89,4.5 178.46,9.07 179.38,9.07 RN2.14
GND  (via drill 0.35)
  Top 0.457: 183.19,26.98 183.79,26.98 IC51.2 183.95,26.75 183.95,25.68 185.01,24.61 190.27,24.61 | 183.19,26.98 182.57,26.98 IC51.1 182.35,26.98 176.02,26.98 174.88,28.12 | 190.27,24.61 191.41,25.76 191.41,26.9 IC51.8 191.57,27.13 192.18,27.74 192.18,34.06 195.99,37.87 195.99,38.33 C2.2 | 183.19,26.98 v183.19,28.42 | R2.1 133.04,39.62 136.93,39.62 R1.1 137.24,39.62 140.97,39.62 R6.1 141.2,39.55 144.78,39.55 146.53,37.8 171.91,37.8 174.88,34.82 174.88,28.12 | v159.49,26.9 154.84,26.9 ADD1.7 | 174.88,28.12 173.89,27.13 ZERO1.7 173.74,26.9 173.74,26.21 170,22.48 166.04,22.48 165.28,23.24 v163.14,23.24 162.99,23.09 161.09,23.09 158.19,20.19 153.54,20.19 151.71,18.36 136.7,18.36 134.95,20.12 ZERO2.7 134.8,20.88 134.8,20.27 133.12,18.59 v119.1,18.59 | v27.89,7.01 26.82,5.94 SUB4.7 26.98,6.4 25.83,7.54 v25.53,7.54 | v41.99,20.34 41.99,21.41 42.44,21.87 ADDB.8 42.6,22.1 43.36,22.86 43.36,29.57 36.04,36.88 27.51,36.88 ADDD.8 | v58.75,8.53 58.75,5.94 SUB2.7 | v72.16,7.16 74.22,7.16 75.74,5.64 75.74,4.95 SUB1.7 | v56.46,24 56.46,36.88 ADDC.8 | v75.74,14.63 75.74,20.88 SUB3.7 | v84.05,19.51 98.68,19.51 99.44,20.27 99.44,20.88 ADDA.8 99.67,20.95 v100.36,20.95 | v116.74,20.95 115.82,20.95 ZERO4.7 | C1.2 12.42,37.95 12.42,11.05 C3.2 12.65,11.05 v17.68,11.05 | 190.27,24.61 195.99,18.9 195.99,14.4 C4.2
  Bottom 0.457: v183.19,28.42 183.72,28.96 183.72,41.99 VCC_GND.2 | v163.14,23.24 v159.49,26.9 | v27.89,7.01 28.65,7.01 v41.99,20.34 53.8,8.53 56.92,8.53 | 56.92,8.53 v58.75,8.53 | 56.92,8.53 56.92,7.39 57.3,7.01 58.06,7.01 58.22,7.16 v72.16,7.16 72.31,7.32 74.07,7.32 75.74,8.99 v75.74,14.63 80.62,19.51 v84.05,19.51 | v56.46,24 56.46,20.73 56.92,20.27 56.92,8.53 | v100.36,20.95 v116.74,20.95 v119.1,18.59 | v17.68,11.05 21.18,7.54 v25.53,7.54
N$65  (via drill 0.35)
  Top 0.152: v49.68,4.34 34.21,19.81 34.21,23.01 24.92,32.31 24.92,36.88 ADDD.6 | v70.33,3.35 70.33,4.5 70.71,4.88 SUB1.3
  Bottom 0.152: v49.68,4.34 51.51,4.34 52.12,4.95 68.73,4.95 v70.33,3.35
N$66  (via drill 0.35)
  Top 0.152: v46.79,4.95 19.89,31.85 19.89,36.88 ADDD.2 | v74.14,3.35 74.14,4.5 74.52,4.88 SUB1.6
  Bottom 0.152: v46.79,4.95 51.66,4.95 51.97,5.26 72.24,5.26 v74.14,3.35
N$67
  Top 0.152: SUB1.8 75.74,11.12 75.74,11.58 74.98,12.34 72.85,12.34 72.62,12.12 72.62,9.75 69.65,6.78 62.71,6.78 58.75,2.82 49.84,2.82 21.72,30.94 21.72,39.17 19.89,41 19.89,43.05 ADDD.15
N$68  (via drill 0.35)
  Top 0.152: v75.21,29.26 75.06,29.26 73.91,28.12 73.91,25.38 71.4,22.86 71.4,18.97 67.59,15.16 67.59,9.98 68.66,8.91 71.32,8.91 71.93,9.53 71.93,11.05 SUB1.11 | v51.05,40.39 49.45,41.99 49.45,44.12 49.23,44.35 30.4,44.35 27.81,41.76 25.76,41.76 24.92,42.6 24.92,43.05 ADDD.11
  Bottom 0.152: v75.21,29.26 75.21,30.48 65.3,40.39 v51.05,40.39
N$77
  Top 0.152: SUB2.3 53.8,5.94 53.8,10.44 54.33,10.97 54.33,13.18 54.25,13.26 54.25,36.58 53.95,36.88 ADDC.6
N$78  (via drill 0.35)
  Top 0.152: v56.16,10.21 58.29,8.08 58.29,7.47 57.61,6.78 57.61,5.94 SUB2.6 | v53.65,22.86 53.65,28.12 48.84,32.92 48.84,36.88 ADDC.2
  Bottom 0.152: v56.16,10.21 56.16,20.34 v53.65,22.86
N$79  (via drill 0.35)
  Top 0.152: v53.65,15.24 48.23,20.65 48.23,38.02 48.77,38.56 48.77,43.05 ADDC.15 | v55.24,13.64 55.7,13.18 55.7,10.9 55.78,10.82 57.99,10.82 58.75,11.58 58.75,12.04 SUB2.8
  Bottom 0.152: v55.24,13.64 v53.65,15.24
N$80
  Top 0.152: ADDC.11 53.95,43.05 53.95,38.56 54.56,37.95 54.56,13.41 54.94,13.03 54.94,12.12 SUB2.11
N$81
  Top 0.152: ADDC.7 55.17,36.96 55.17,41.38 54.48,42.06 54.48,44.2 53.42,45.26 29.64,45.26 27.51,43.13 ADDD.9
N$82  (via drill 0.35)
  Top 0.152: v30.33,4.65 26.36,4.65 25.6,5.41 25.6,5.87 SUB4.6 | v88.09,20.57 90.6,23.09 91.21,23.09 91.82,22.48 91.82,20.95 ADDA.2
  Bottom 0.152: v30.33,4.65 45.57,4.65 46.48,5.56 66.06,5.56 67.06,6.55 74.07,6.55 v88.09,20.57
N$83  (via drill 0.35)
  Top 0.152: v26.82,16.61 26.82,12.12 SUB4.8 | v93.8,30.71 93.8,30.25 91.9,28.35 91.9,27.13 ADDA.15
  Bottom 0.152: v26.82,16.61 27.13,16.61 38.1,27.58 38.1,30.86 50.37,43.13 88.77,43.13 89.08,43.43 99.06,43.43 99.97,42.52 102.95,42.52 103.78,41.68 103.78,40.84 102.64,39.7 102.41,39.7 101.27,38.56 101.27,38.18 v93.8,30.71
N$84  (via drill 0.35)
  Top 0.152: v23.77,13.64 23.01,12.88 23.01,12.12 SUB4.11 | v67.28,27.89 70.48,31.09 81,31.09 v84.73,27.36 | v96.24,28.57 96.24,27.74 96.85,27.13 ADDA.11
  Bottom 0.152: v23.77,13.64 24.77,13.64 37.03,25.91 40.23,25.91 42.22,27.89 v67.28,27.89 | v84.73,27.36 91.29,27.36 91.97,28.04 95.71,28.04 v96.24,28.57
N$85  (via drill 0.35)
  Top 0.152: v25.15,9.75 21.79,6.4 21.79,5.94 SUB4.3 | v55.7,23.47 56.08,23.47 56.16,23.39 v67.51,23.39 | v96.77,22.48 96.77,21.03 96.85,20.95 ADDA.6
  Bottom 0.152: v25.15,9.75 30.48,9.75 44.2,23.47 v55.7,23.47 | v67.51,23.39 87.94,23.39 88.92,24.38 94.87,24.38 v96.77,22.48
N$86  (via drill 0.35)
  Top 0.152: v42.14,29.64 42.44,29.34 42.44,28.12 ADDB.9 | v94.49,28.65 95.02,28.12 95.02,25.15 98.15,22.02 98.15,20.95 ADDA.7
  Bottom 0.152: v42.14,29.64 69.27,29.64 72.39,26.52 81.84,26.52 94.18,38.86 94.18,39.09 94.79,39.7 95.56,39.7 96.16,39.09 96.16,33.98 93.19,31.01 93.19,29.95 v94.49,28.65
N$91
  Top 0.152: SUB3.11 71.93,27.05 71.93,23.85 70.03,21.95 70.03,18.06 60.05,8.08 60.05,4.57 58.6,3.12 51.82,3.12 39.32,15.62 39.32,27.51 39.85,28.04 ADDB.11
N$92  (via drill 0.35)
  Top 0.152: v76.73,27.13 75.82,27.13 SUB3.8 | v40.23,30.25 39.93,30.25 37.64,32.54 37.03,32.54 34.9,30.4 34.9,28.12 ADDB.15
  Bottom 0.152: v76.73,27.13 72.24,27.13 69.11,30.25 v40.23,30.25
N$93  (via drill 0.35)
  Top 0.152: v73.15,22.78 74.52,21.41 74.52,20.95 SUB3.6 | v35.51,23.47 35.51,22.55 34.9,21.95 ADDB.2
  Bottom 0.152: v73.15,22.78 58.6,22.78 56.77,24.61 39.85,24.61 38.41,23.16 35.81,23.16 v35.51,23.47
N$94  (via drill 0.35)
  Top 0.152: v70.71,19.36 70.71,20.88 SUB3.3 | v55.17,19.36 v57.68,19.36 | v44.12,19.36 42.06,19.36 39.93,21.49 39.93,21.87 ADDB.6
  Bottom 0.152: v57.68,19.36 v70.71,19.36 | v44.12,19.36 v55.17,19.36
N$95  (via drill 0.35)
  Top 0.152: v40.92,30.86 40.92,30.02 40.62,29.72 40.62,26.9 41.15,26.36 41.15,21.95 ADDB.7 | v55.17,34.75 55.17,35.2 55.85,35.89 55.85,42.52 56.39,43.05 ADDC.9
  Bottom 0.152: v40.92,30.86 51.28,30.86 v55.17,34.75
N$101  (via drill 0.35)
  Top 0.152: v151.26,28.5 151.03,28.27 151.03,26.98 ADD1.4 | v158.42,28.5 164.59,28.5 166.12,26.98 ZERO1.1
  Bottom 0.152: v158.42,28.5 v151.26,28.5
N$102
  Top 0.152: ADD1.5 152.32,26.9 152.32,25.98 154.46,23.85 165.35,23.85 166.27,22.94 169.7,22.94 170,23.24 170,26.9 ZERO1.4
N$103
  Top 0.152: ADD1.9 153.54,33.15 153.54,33.53 155.3,35.28 169.47,35.28 171.22,33.53 171.22,33.15 ZERO1.10
N$104
  Top 0.152: ADD1.10 152.32,33.07 152.32,32.16 153.01,31.47 166.27,31.47 167.41,32.61 167.41,33.07 ZERO1.13
N$105
  Top 0.152: ZERO4.10 113.31,27.13 113.31,27.58 121.84,36.12 150.95,36.12 152.93,34.14 152.93,32 153.16,31.77 153.92,31.77 154.76,32.61 154.76,33.07 ADD1.8
N$106
  Top 0.152: ZERO4.9 114.61,27.13 114.61,27.58 122.83,35.81 149.96,35.81 151.64,34.14 151.64,29.72 153.47,27.89 153.47,26.98 ADD1.6
N$107
  Top 0.152: ZERO4.12 110.8,27.05 110.8,26.59 111.63,25.76 114.91,25.76 115.75,26.59 115.75,27.05 ZERO4.8
N$108
  Top 0.152: ZERO4.13 109.5,27.05 109.5,26.14 113.46,22.17 113.77,22.17 114.53,21.41 114.53,20.95 ZERO4.6
N$109
  Top 0.152: ZERO4.4 112.01,20.88 112.01,20.5 112.85,19.66 122.76,19.66 129.16,26.06 129.16,28.19 136.47,35.51 148.97,35.51 150.95,33.53 150.95,33.15 ADD1.11
N$110
  Top 0.152: ZERO4.3 110.8,20.95 110.8,21.41 111.56,22.17 112.47,22.17 113.23,21.41 113.23,20.95 ZERO4.5
N$111
  Top 0.152: ZERO4.1 108.2,20.88 108.2,20.5 109.35,19.36 123.9,19.36 129.46,24.92 130.61,24.92 132.21,26.52 132.21,27.05 ZERO2.10
N$112
  Top 0.152: ZERO4.2 109.42,20.95 109.42,25.38 108.89,25.91 108.89,28.19 109.04,28.35 109.88,28.35 110.11,28.12 110.11,25.98 110.64,25.45 127.25,25.45 128.4,26.59 128.4,27.05 ZERO2.13
N$113
  Top 0.152: ZERO2.1 127.25,20.95 127.25,21.41 130.38,24.54 136.02,24.54 146.69,35.2 148.51,35.2 149.66,34.06 149.66,33.15 ADD1.12
N$114
  Top 0.152: ZERO2.4 131.06,20.95 131.06,21.41 133.88,24.23 140.06,24.23 148.44,32.61 148.44,33.07 ADD1.13
N$120
  Bottom 0.152: IC27.1 155.83,15.93 158.27,15.93 162,12.19 162,9.37 155.91,3.28 129.46,3.28 128.02,4.72 SV5.3
N$121  (via drill 0.35)
  Top 0.152: v154.46,14.55 152.93,16.08 152.93,17.98 v154.08,19.13 | v153.01,20.8 149.81,20.8 147.98,18.97 146.15,18.97 v146,19.13 | v142.88,16 136.7,16 128.02,7.32 SV5.4
  Bottom 0.152: v154.46,14.55 154.61,14.4 155.75,14.4 IC27.3 | v154.08,19.13 154.08,19.74 v153.01,20.8 | v142.88,16 v146,19.13
N$122
  Bottom 0.152: IC27.2 155.75,15.16 153.77,15.16 146.84,8.23 146.23,8.23 143.1,5.11 132.82,5.11 130.61,7.32 SV5.6
N$123  (via drill 0.35)
  Top 0.152: v153.16,13.64 152.71,13.64 149.28,17.07 135.25,17.07 125.5,7.32 SV5.2
  Bottom 0.152: v153.16,13.64 155.75,13.64 IC27.4
N$124  (via drill 0.35)
  Top 0.152: v180.9,16.76 164.36,16.76 162.08,19.05 U$1.PIN13
  Bottom 0.152: v180.9,16.76 186.61,16.76 RN2.1
N$125
  Bottom 0.152: RN2.2 186.61,15.39 180.97,15.39 180.44,14.86 176.4,14.86 172.21,19.05 U$1.PIN9
N$126
  Bottom 0.152: RN2.3 181.05,14.17 180.44,13.56 176.78,13.56 U$1.PIN4
N$127
  Bottom 0.152: RN2.4 186.69,12.88 187,12.88 188.14,11.73 188.14,6.4 187.6,5.87 184.78,5.87 181.05,2.13 163.75,2.13 162.08,3.81 U$1.PIN2
N$128
  Bottom 0.152: RN2.5 186.61,11.66 186.23,11.66 185.4,12.5 185.4,13.34 185.55,13.49 187.68,13.49 188.44,12.72 188.44,5.49 184.78,1.83 161.47,1.83 159.49,3.81 U$1.PIN1
N$129  (via drill 0.35)
  Top 0.152: v181.51,13.56 181.51,17.07 180.29,18.29 165.35,18.29 164.59,19.05 U$1.PIN12
  Bottom 0.152: v181.51,13.56 184.63,10.44 186.61,10.44 RN2.6
N$130
  Bottom 0.152: RN2.7 186.61,9.14 180.97,9.14 180.44,9.68 175.49,9.68 169.7,3.89 U$1.PIN5
N$138
  Top 0.152: R6.2 141.05,42.37 143.1,42.37 145.39,40.08 153.09,40.08 154.91,41.91 161.39,41.91 162.23,41.07 LED1.K
N$139
  Top 0.152: R1.2 137.01,42.37 138.84,42.37 140.51,40.69 144.32,40.69 145.24,39.78 154,39.78 155.22,41 LED2.K
N$140
  Top 0.152: R2.2 133.04,42.44 134.87,42.44 135.87,43.43 145.85,43.43 148.21,41.07 LED3.K
N$141
  Bottom 0.152: RN2.8 186.61,7.77 183.49,7.77 178.46,2.74 165.66,2.74 164.59,3.81 U$1.PIN3
N$142
  Bottom 0.152: 144.21,18.25 147.98,22.02 148.9,22.02 149.2,21.72 149.2,17.83 IC27.38 | 144.21,18.25 142.26,16.31 142.26,12.57 143.64,11.2 144.17,11.2 IC27.27 | IC27.5 155.75,12.72 153.39,12.72 150.04,9.37 150.04,6.25 IC27.17 149.96,6.17 149.96,5.56 148.59,4.19 132.82,4.19 132.28,4.72 130.61,4.72 SV5.5 130.53,4.8 129.24,6.1 129.24,21.64 133.66,26.06 136.4,26.06 144.21,18.25
N$143  (via drill 0.35)
  Top 0.152: v145.54,11.2 148.4,8.34 | 148.4,8.34 v149.2,7.54 149.2,7.62 v150.65,9.07 | 148.4,8.34 146.38,6.33 128.25,6.33 126.72,4.8 125.5,4.8 SV5.1
  Bottom 0.152: IC27.29 144.25,12.72 144.25,12.04 IC27.28 144.32,12.04 144.7,12.04 145.05,11.7 | v149.2,7.54 149.2,6.25 IC27.18 | 145.05,11.7 v145.54,11.2 | v150.65,9.07 153.54,11.96 155.75,11.96 IC27.6 | 145.05,11.7 149.96,16.61 149.96,17.75 IC27.39
NEG_OUT  (via drill 0.35)
  Top 0.152: v186.16,25.38 186.31,25.53 186.31,26.9 IC51.4
  Bottom 0.152: v186.16,25.38 185.32,25.38 182.19,28.5 182.19,43.05 181.59,43.66 173.35,43.66 171.75,42.06 FLAGS.2 171.68,41.99 169.77,40.08 154.91,40.08 154,41 152.78,41 LED2.A
REGA0
  Top 0.152: ADDD.5 23.7,36.96 23.7,41.45 24.31,42.06 24.31,44.2 25.68,45.57 82.83,45.57 89.61,38.79 90.07,38.79 REGA.1
REGA1
  Top 0.152: ADDD.3 21.03,36.96 21.03,39.4 19.2,41.22 19.2,44.2 21.18,46.18 83.13,46.18 88.01,41.3 90.07,41.3 REGA.2
REGA2  (via drill 0.35)
  Top 0.152: v21.11,40.69 21.11,43.05 ADDD.14 | v84.66,45.57 85.11,45.57 88.47,42.22 93.04,42.22 93.65,41.6 93.65,39.78 92.66,38.79 REGA.3
  Bottom 0.152: v21.11,40.69 21.11,39.55 22.78,37.87 43.28,37.87 50.98,45.57 v84.66,45.57
REGA3
  Top 0.152: ADDD.12 23.7,43.13 23.7,44.04 25.53,45.87 82.98,45.87 88.54,40.31 91.67,40.31 92.58,41.22 REGA.4
REGA4  (via drill 0.35)
  Top 0.152: v53.65,29.03 52.65,30.02 52.65,36.88 ADDC.5
  Bottom 0.152: v53.65,29.03 69.42,29.03 72.24,26.21 82.68,26.21 95.17,38.71 REGA.5
REGA5  (via drill 0.35)
  Top 0.152: v52.58,41 50.14,38.56 50.14,36.96 ADDC.3
  Bottom 0.152: v52.58,41 89,41 89.69,40.31 94.26,40.31 95.17,41.22 REGA.6
REGA6  (via drill 0.35)
  Top 0.152: v51.28,41.45 50.14,42.6 50.14,43.05 ADDC.14
  Bottom 0.152: v51.28,41.45 52.12,41.45 52.88,42.22 89.23,42.22 89.53,42.52 97.84,42.52 98.68,41.68 98.68,39.7 97.77,38.79 REGA.7
REGA7  (via drill 0.35)
  Top 0.152: v53.26,41.6 52.65,42.22 52.65,43.05 ADDC.12
  Bottom 0.152: v53.26,41.6 89.08,41.6 89.69,42.22 96.77,42.22 97.69,41.3 REGA.8
REGA8  (via drill 0.35)
  Top 0.152: v38.71,26.52 38.71,21.95 ADDB.5
  Bottom 0.152: v38.71,26.52 38.71,29.64 47.17,38.1 47.17,38.79 50.9,42.52 89.08,42.52 89.38,42.82 97.99,42.82 99.29,41.53 99.29,39.7 100.2,38.79 REGA.9
REGA9  (via drill 0.35)
  Top 0.152: v36.12,26.52 36.12,21.95 ADDB.3 | v100.2,43.2 100.2,41.3 REGA.10
  Bottom 0.152: v36.12,26.52 36.12,28.88 37.8,30.56 37.8,31.01 50.22,43.43 88.62,43.43 88.92,43.74 99.67,43.74 v100.2,43.2
REGA10  (via drill 0.35)
  Top 0.152: v36.12,29.79 36.12,28.12 ADDB.14
  Bottom 0.152: v36.12,29.79 50.06,43.74 88.47,43.74 88.77,44.04 101.88,44.04 104.09,41.83 104.09,40.01 102.87,38.79 REGA.11
REGA11  (via drill 0.35)
  Top 0.152: v38.71,30.56 38.71,28.12 ADDB.12
  Bottom 0.152: v38.71,30.56 38.71,30.79 50.75,42.82 88.92,42.82 89.23,43.13 98.91,43.13 99.82,42.22 101.88,42.22 102.79,41.3 REGA.12
REGA12
  Top 0.152: ADDA.5 95.63,20.95 95.63,22.94 92.81,25.76 92.73,25.76 92.51,25.98 92.51,28.5 101.73,37.72 104.32,37.72 105.31,38.71 REGA.13
REGA13
  Top 0.152: ADDA.3 93.04,20.95 93.04,24.16 91.21,25.98 91.21,29.03 99.9,37.72 100.66,37.72 101.8,38.86 101.8,39.09 103.02,40.31 104.39,40.31 105.31,41.22 REGA.14
REGA14  (via drill 0.35)
  Top 0.152: v102.03,37.11 93.12,28.19 93.12,27.13 ADDA.14
  Bottom 0.152: v102.03,37.11 106.22,37.11 107.82,38.71 REGA.15
REGA15
  Top 0.152: ADDA.12 95.63,27.13 95.63,28.88 104.17,37.41 105.39,37.41 106.91,38.94 106.91,40.31 107.82,41.22 REGA.16
REGB0
  Top 0.152: SUB1.2 69.49,4.88 69.49,3.28 70.33,2.44 88.77,2.44 91.06,4.72 REGB.1
REGB1
  Top 0.152: SUB1.5 73.3,4.88 73.3,3.28 73.84,2.74 86.56,2.74 91.06,7.24 REGB.2
REGB2
  Top 0.152: SUB1.10 73.3,11.05 73.3,8.61 73.91,8 90.45,8 90.68,8.23 91.52,8.23 92.35,7.39 92.35,6.1 93.65,4.8 REGB.3
REGB3
  Top 0.152: SUB1.13 69.49,11.12 69.49,11.58 70.56,12.65 88.32,12.65 93.65,7.32 REGB.4
REGB4  (via drill 0.35)
  Top 0.152: v52.43,4.34 52.43,5.87 SUB2.2 | v94.56,3.12 96.16,4.72 REGB.5
  Bottom 0.152: v52.43,4.34 55.32,1.45 92.89,1.45 v94.56,3.12
REGB5  (via drill 0.35)
  Top 0.152: v57.68,7.77 56.31,6.4 56.31,5.94 SUB2.5 | v74.22,8.61 91.59,8.61 92.66,7.54 92.66,6.86 93.19,6.33 95.25,6.33 96.16,7.24 REGB.6
  Bottom 0.152: v57.68,7.77 73.38,7.77 v74.22,8.61
REGB6  (via drill 0.35)
  Top 0.152: v57.68,14.02 56.31,12.65 56.31,12.12 SUB2.10 | v82.98,14.02 v74.98,14.02
  Bottom 0.152: v74.98,14.02 v57.68,14.02 | v82.98,14.02 91.29,5.71 97.77,5.71 98.68,4.8 REGB.7
REGB7  (via drill 0.35)
  Top 0.152: v53.34,4.34 53.11,4.57 53.11,7.01 52.5,7.62 52.5,12.04 SUB2.13 | v93.04,2.74 95.25,4.95 95.25,5.18 96.39,6.33 97.77,6.33 98.68,7.24 REGB.8
  Bottom 0.152: v53.34,4.34 68.43,4.34 70.03,2.74 v93.04,2.74
REGB8
  Top 0.152: SUB3.2 69.49,20.95 69.49,24.16 71.4,26.06 71.4,28.19 73.38,30.18 76.28,30.18 83.44,23.01 83.44,19.2 94.11,8.53 101.35,8.53 102.26,7.62 102.26,5.71 101.35,4.8 REGB.9
REGB9  (via drill 0.35)
  Top 0.152: v74.37,19.36 73.3,20.42 73.3,20.88 SUB3.5
  Bottom 0.152: v74.37,19.36 79.78,19.36 81.61,21.18 88.39,21.18 101.27,8.31 101.27,7.32 REGB.10
REGB10
  Top 0.152: SUB3.10 73.3,27.13 73.3,28.27 74.91,29.87 76.12,29.87 83.13,22.86 83.13,19.05 93.95,8.23 99.14,8.23 100.28,7.09 100.28,4.34 100.89,3.73 102.79,3.73 103.78,4.72 REGB.11
REGB11  (via drill 0.35)
  Top 0.152: v71.32,29.03 71.02,29.03 69.49,27.51 69.49,27.13 SUB3.13 | v82.53,22.55 v77.04,28.04
  Bottom 0.152: v71.32,29.03 74.52,29.03 75.51,28.04 v77.04,28.04 | v82.53,22.55 88.54,22.55 103.78,7.32 REGB.12
REGB12
  Top 0.152: SUB4.2 20.42,5.94 20.42,10.44 19.81,11.05 19.81,30.56 17.98,32.38 17.98,44.2 20.27,46.48 84.66,46.48 87.33,43.81 106.68,43.81 108.89,41.6 108.89,31.85 104.39,27.36 104.39,10.59 107.37,7.62 107.37,5.79 106.38,4.8 REGB.13
REGB13
  Top 0.152: SUB4.5 24.31,5.87 24.31,5.49 28.65,1.14 90.07,1.14 91.59,2.67 92.2,2.67 92.73,2.13 102.56,2.13 105.39,4.95 105.39,6.33 106.3,7.24 REGB.14
REGB14  (via drill 0.35)
  Top 0.152: v92.2,3.73 89.99,1.52 34.37,1.52 24.31,11.58 24.31,12.04 SUB4.10
  Bottom 0.152: v92.2,3.73 107.9,3.73 REGB.15
REGB15  (via drill 0.35)
  Top 0.152: v21.11,13.56 20.5,12.95 20.5,12.12 SUB4.13 | v65.76,6.17 66.98,6.17 v67.28,5.87
  Bottom 0.152: v21.11,13.56 21.11,12.88 27.81,6.17 v65.76,6.17 | v67.28,5.87 73.91,5.87 82.68,14.63 92.73,14.63 100.28,7.09 100.28,6.86 100.81,6.33 107.97,6.33 108.89,7.24 REGB.16
VCC  (via drill 0.35)
  Top 0.457: SUB4.9 25.53,12.12 25.53,13.03 24.16,14.4 23.39,14.4 21.79,12.8 21.79,12.12 SUB4.12 21.64,11.89 21.64,11.12 v21.03,10.52 | SUB4.4 22.94,5.87 22.94,5.18 22.25,4.5 19.96,4.5 19.2,5.26 19.2,5.87 SUB4.1 19.2,6.1 19.2,9.68 | 19.2,9.68 19.2,10.52 | 19.2,10.52 19.2,12.04 SUB4.14 | v19.36,10.52 19.2,10.52 | ADDB.16 33.53,28.12 33.53,28.96 26.21,36.27 26.21,36.88 ADDD.7 | v18.59,41.45 18.59,43.05 ADDD.16 | v24.69,39.09 26.06,37.72 26.06,37.11 ADDD.7 | 46.79,43.05 31.39,43.05 26.21,37.87 ADDD.7 | 46.79,43.05 47.55,43.05 ADDC.16 | SUB3.9 74.52,27.05 74.52,25.3 72.01,22.78 72.01,20.95 SUB3.4 71.93,20.73 71.93,15.47 68.28,11.81 68.28,11.28 SUB1.14 68.2,11.05 68.2,10.44 69.04,9.6 69.88,9.6 70.41,10.13 | 71.25,6.33 68.96,6.33 68.2,5.56 68.2,4.95 SUB1.1 | 71.25,6.33 71.93,5.64 71.93,4.95 SUB1.4 | 70.41,10.13 70.71,10.44 70.71,11.05 SUB1.12 | v73.91,9.6 74.52,10.21 74.52,11.05 SUB1.9 | 70.41,10.13 v71.02,9.53 | v72.16,8.38 71.4,7.62 71.4,6.48 71.25,6.33 | 54.94,4.8 54.94,5.87 SUB2.4 | 54.94,4.8 53.72,3.58 52.05,3.58 51.28,4.34 51.28,5.71 SUB2.1 51.21,5.94 51.21,12.04 SUB2.14 51.28,12.27 51.28,12.8 51.97,13.49 | 51.97,13.49 52.96,13.49 53.72,12.72 53.72,12.12 SUB2.12 | 58.83,14.02 65.68,20.88 68.12,20.88 SUB3.1 68.28,21.11 68.28,24.84 69.04,25.6 | 58.83,14.02 57.61,12.8 57.61,12.12 SUB2.9 | 59.59,9.6 59.59,13.26 58.83,14.02 | 59.59,9.6 59.59,4.8 59.28,4.5 55.78,4.5 55.63,4.65 55.09,4.65 54.94,4.8 | v59.74,9.6 59.59,9.6 | IC51.16 182.5,33.15 182.5,40.69 181.2,41.99 VCC_GND.1 | 69.04,25.6 68.2,26.44 68.2,27.05 SUB3.14 68.28,27.28 68.28,27.81 71.09,30.63 76.5,30.63 84.12,23.01 89.61,23.01 90.53,23.93 90.53,25.45
  Top 0.457: 69.04,25.6 69.88,25.6 70.71,26.44 70.71,27.05 SUB3.12 | 90.53,25.45 90.53,27.05 ADDA.16 | v105,27.05 108.13,27.05 ZERO4.14 | v90.75,25.45 90.53,25.45 | v116.74,27.05 127.18,27.05 ZERO2.14 | v145.47,33.07 147.14,33.07 ADD1.14 | v155.68,33.07 166.12,33.07 ZERO1.14 | 46.79,43.05 46.79,18.67 51.97,13.49 | C2.1 196.06,35.59 197.28,34.37 197.28,13.41 196.06,12.19 196.06,11.66 C4.1 195.91,12.34 195.76,12.34 v182.73,25.38 | 19.2,9.68 11.43,9.68 10.13,10.97 9.6,10.97 C3.1 | v11.05,38.02 9.6,38.02 C1.1
  Bottom 0.457: v19.36,10.52 20.19,10.52 | 20.19,10.52 v21.03,10.52 | 20.19,41.45 22.33,41.45 v24.69,39.09 | 20.19,41.45 v18.59,41.45 | 20.19,41.45 20.19,38.02 | 20.19,38.02 20.19,10.52 | 72.16,9.6 71.09,9.6 v71.02,9.53 70.87,9.6 v59.74,9.6 | 72.16,9.6 v73.91,9.6 | 72.16,9.6 v72.16,8.38 | v90.75,25.45 92.35,27.05 v105,27.05 v116.74,27.05 122.76,33.07 v145.47,33.07 v155.68,33.07 155.83,33.22 170.31,33.22 172.59,35.51 | 172.59,35.51 179.07,41.99 181.13,41.99 VCC_GND.1 | 20.19,38.02 v11.05,38.02 | 172.59,35.51 v182.73,25.38
ZERO_FLAG  (via drill 0.35)
  Top 0.152: v128.4,43.89 112.01,27.51 112.01,27.13 ZERO4.11 | v135.41,43.89 170.61,43.89 170.69,43.97 176.94,43.97 181.97,38.94 181.97,31.93 182.12,31.77 184.25,31.77 185.09,32.61 IC51.14
  Bottom 0.152: v135.41,43.89 v128.4,43.89
ZERO_OUT
  Top 0.152: IC51.3 185.09,26.98 185.09,27.89 175.26,37.72 175.26,43.05 174.65,43.66 170.84,43.66 169.24,42.06 FLAGS.1
  Bottom 0.152: LED3.A 145.77,41.07 147.07,41.07 147.98,41.99 169.16,41.99 FLAGS.1